# EAGLE design PCB-BI8-1x8SC3x (EAGLE 7.5.0)
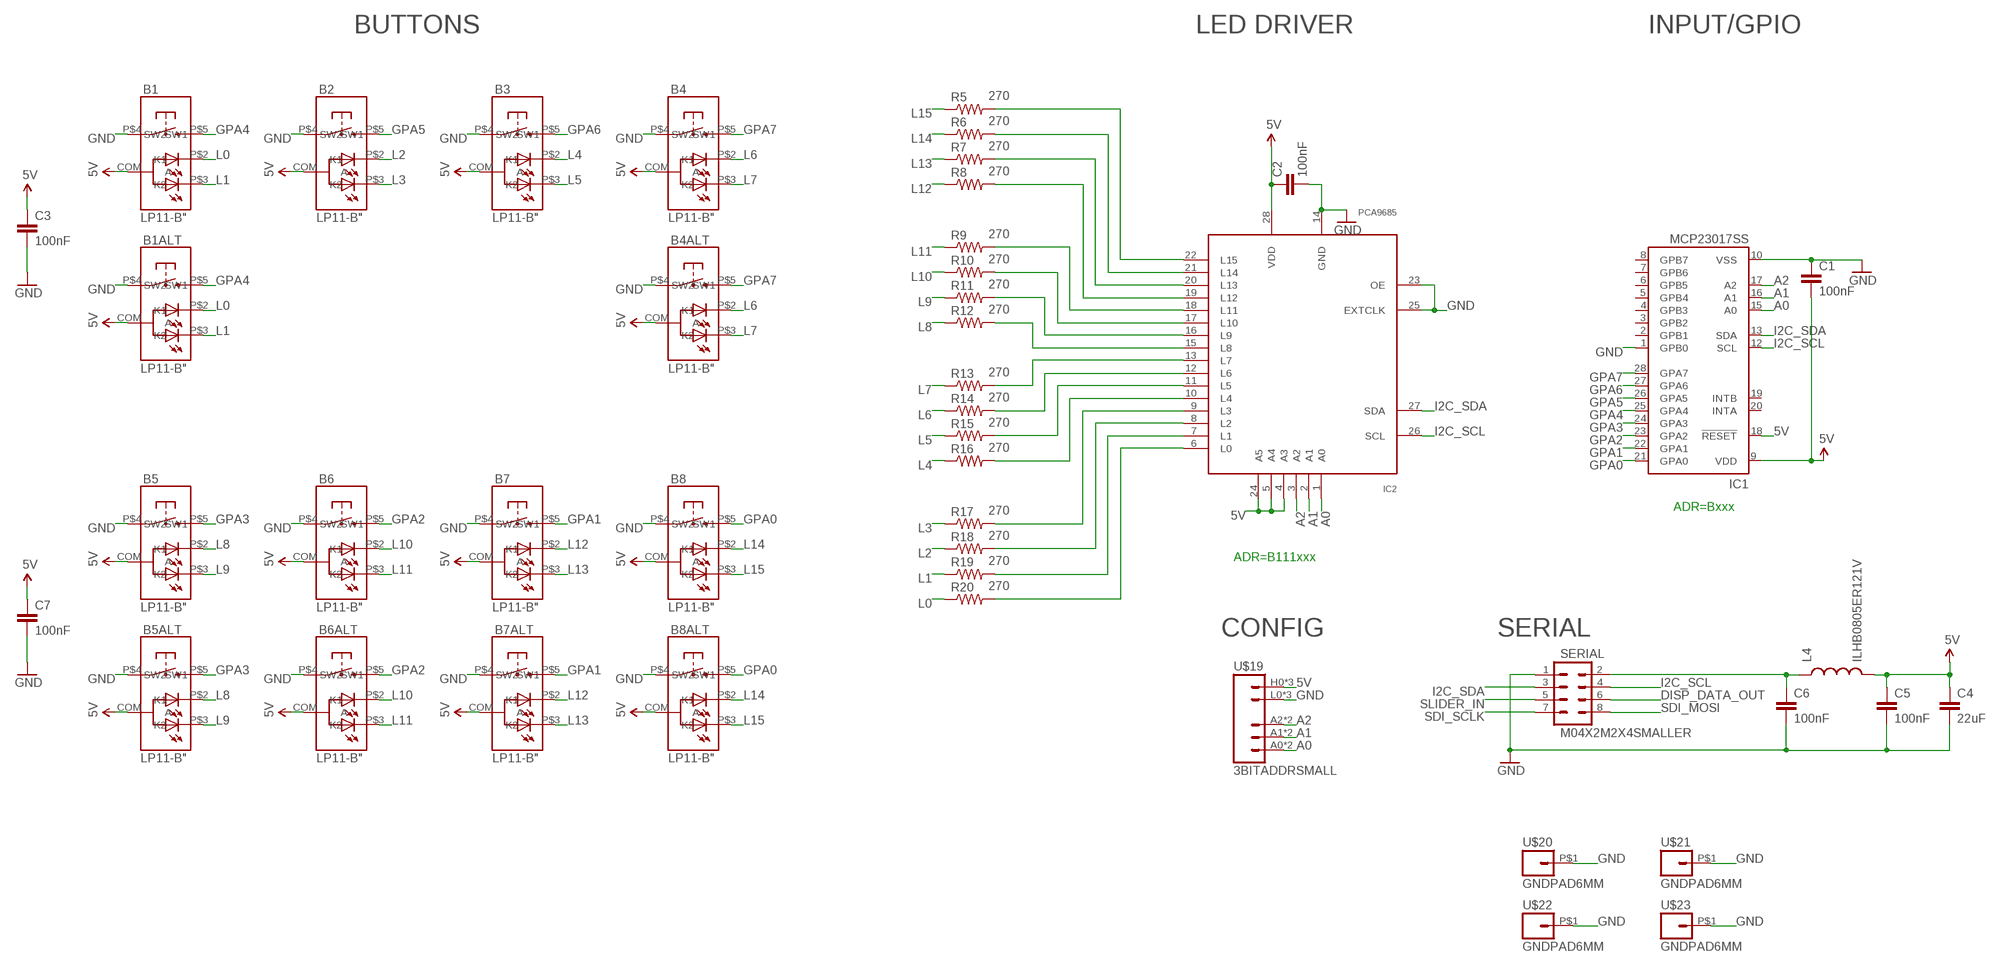
[diagram p0: schematic, sheet 1]

## Parts
B1  LP11-B"  [LP11]
B1ALT  LP11-B"  [LP11]
B2  LP11-B"  [LP11]
B3  LP11-B"  [LP11]
B4  LP11-B"  [LP11]
B4ALT  LP11-B"  [LP11]
B5  LP11-B"  [LP11]
B5ALT  LP11-B"  [LP11]
B6  LP11-B"  [LP11]
B6ALT  LP11-B"  [LP11]
B7  LP11-B"  [LP11]
B7ALT  LP11-B"  [LP11]
B8  LP11-B"  [LP11]
B8ALT  LP11-B"  [LP11]
C1  100nF  CAP0603-CAP  [0603-CAP]
C2  100nF  CAP0603-CAP  [0603-CAP]
C3  100nF  CAP0603-CAP  [0603-CAP]
C4  22uF  CAP0805  [0805]
C5  100nF  CAP0603-CAP  [0603-CAP]
C6  100nF  CAP0603-CAP  [0603-CAP]
C7  100nF  CAP0603-CAP  [0603-CAP]
IC1  MCP23017SS  [SSOP28]
IC2  PCA9685  [TSSOP28]
L4  ILHB0805ER121V  INDUCTOR0805  [0805]
R5  270  RESISTOR0603-RES  [0603-RES]
R6  270  RESISTOR0603-RES  [0603-RES]
R7  270  RESISTOR0603-RES  [0603-RES]
R8  270  RESISTOR0603-RES  [0603-RES]
R9  270  RESISTOR0603-RES  [0603-RES]
R10  270  RESISTOR0603-RES  [0603-RES]
R11  270  RESISTOR0603-RES  [0603-RES]
R12  270  RESISTOR0603-RES  [0603-RES]
R13  270  RESISTOR0603-RES  [0603-RES]
R14  270  RESISTOR0603-RES  [0603-RES]
R15  270  RESISTOR0603-RES  [0603-RES]
R16  270  RESISTOR0603-RES  [0603-RES]
R17  270  RESISTOR0603-RES  [0603-RES]
R18  270  RESISTOR0603-RES  [0603-RES]
R19  270  RESISTOR0603-RES  [0603-RES]
R20  270  RESISTOR0603-RES  [0603-RES]
SERIAL  M04X2M2X4SMALLER  [M2X4SMALLER]
U$19  3BITADDRSMALL  [3BITADDR_SMALL]
U$20  GNDPAD6MM  [3.2MMPAD6MM]
U$21  GNDPAD6MM  [3.2MMPAD6MM]
U$22  GNDPAD6MM  [3.2MMPAD6MM]
U$23  GNDPAD6MM  [3.2MMPAD6MM]

## Nets
5V [Power]: B1.COM(A) B1ALT.COM(A) B2.COM(A) B3.COM(A) B4.COM(A) B4ALT.COM(A) B5.COM(A) B5ALT.COM(A) B6.COM(A) B6ALT.COM(A) B7.COM(A) B7ALT.COM(A) B8.COM(A) B8ALT.COM(A) C1.2 C2.1 C3.1 C4.1 C5.1 C7.1 IC1.9(VDD) IC1.18(!RESET) IC2.4(A3) IC2.5(A4) IC2.24(A5) IC2.28(VDD) L4.2 U$19.H0(VCC) U$19.H1(VCC) U$19.H2(VCC)
A0: IC1.15(A0) IC2.1(A0) U$19.A0 U$19.AS0(A0)
A1: IC1.16(A1) IC2.2(A1) U$19.A1 U$19.AS1(A1)
A2: IC1.17(A2) IC2.3(A2) U$19.A2 U$19.AS2(A2)
DISP_DATA_OUT: SERIAL.6
GND [Power]: B1.P$4(SW1) B1ALT.P$4(SW1) B2.P$4(SW1) B3.P$4(SW1) B4.P$4(SW1) B4ALT.P$4(SW1) B5.P$4(SW1) B5ALT.P$4(SW1) B6.P$4(SW1) B6ALT.P$4(SW1) B7.P$4(SW1) B7ALT.P$4(SW1) B8.P$4(SW1) B8ALT.P$4(SW1) C1.1 C2.2 C3.2 C4.2 C5.2 C6.2 C7.2 IC1.1(GPB0) IC1.10(VSS) IC2.14(GND) IC2.23(OE) IC2.25(EXTCLK) SERIAL.1 U$19.L0(GND) U$19.L1(GND) U$19.L2(GND) U$20.P$1 U$21.P$1 U$22.P$1 U$23.P$1
GPA0: B8.P$5(SW2) B8ALT.P$5(SW2) IC1.21(GPA0)
GPA1: B7.P$5(SW2) B7ALT.P$5(SW2) IC1.22(GPA1)
GPA2: B6.P$5(SW2) B6ALT.P$5(SW2) IC1.23(GPA2)
GPA3: B5.P$5(SW2) B5ALT.P$5(SW2) IC1.24(GPA3)
GPA4: B1.P$5(SW2) B1ALT.P$5(SW2) IC1.25(GPA4)
GPA5: B2.P$5(SW2) IC1.26(GPA5)
GPA6: B3.P$5(SW2) IC1.27(GPA6)
GPA7: B4.P$5(SW2) B4ALT.P$5(SW2) IC1.28(GPA7)
I2C_SCL: IC1.12(SCL) IC2.26(SCL) SERIAL.4
I2C_SDA: IC1.13(SDA) IC2.27(SDA) SERIAL.3
L0: B1.P$2(K1) B1ALT.P$2(K1) R20.1
L1: B1.P$3(K2) B1ALT.P$3(K2) R19.1
L2: B2.P$2(K1) R18.1
L3: B2.P$3(K2) R17.1
L4: B3.P$2(K1) R16.1
L5: B3.P$3(K2) R15.1
L6: B4.P$2(K1) B4ALT.P$2(K1) R14.1
L7: B4.P$3(K2) B4ALT.P$3(K2) R13.1
L8: B5.P$2(K1) B5ALT.P$2(K1) R12.1
L9: B5.P$3(K2) B5ALT.P$3(K2) R11.1
L10: B6.P$2(K1) B6ALT.P$2(K1) R10.1
L11: B6.P$3(K2) B6ALT.P$3(K2) R9.1
L12: B7.P$2(K1) B7ALT.P$2(K1) R8.1
L13: B7.P$3(K2) B7ALT.P$3(K2) R7.1
L14: B8.P$2(K1) B8ALT.P$2(K1) R6.1
L15: B8.P$3(K2) B8ALT.P$3(K2) R5.1
N$1 [Power]: C6.1 L4.1 SERIAL.2
N$4: IC2.13(L7) R13.2
N$5: IC2.12(L6) R14.2
N$7: IC2.11(L5) R15.2
N$9: IC2.10(L4) R16.2
N$10: IC2.9(L3) R17.2
N$11: IC2.8(L2) R18.2
N$12: IC2.7(L1) R19.2
N$19: IC2.6(L0) R20.2
N$20: IC2.15(L8) R12.2
N$21: IC2.16(L9) R11.2
N$22: IC2.17(L10) R10.2
N$23: IC2.18(L11) R9.2
N$24: IC2.19(L12) R8.2
N$25: IC2.20(L13) R7.2
N$26: IC2.21(L14) R6.2
N$27: IC2.22(L15) R5.2
SDI_MOSI: SERIAL.8
SDI_SCLK: SERIAL.7
SLIDER_IN: SERIAL.5
Unconnected: IC1.2(GPB1) IC1.3(GPB2) IC1.4(GPB3) IC1.5(GPB4) IC1.6(GPB5) IC1.7(GPB6) IC1.8(GPB7) IC1.19(INTB) IC1.20(INTA)

## Notes on the sheet
- BUTTONS | LED DRIVER | INPUT/GPIO
- ADR=Bxxx
- ADR=B111xxx
- CONFIG | SERIAL

## Library data of the parts
B1 B1ALT B2-B4 B4ALT B5 B5ALT B6 B6ALT B7 B7ALT B8 B8ALT = SKAARHOJ:LP11-B
C1-C7 = SparkFun:CAP: Capacitor Standard 0603 ceramic capacitor, and 0.1" leaded capacitor.
IC1 = microchip:MCP23017: http://ww1.microchip.com/downloads/en/DeviceDoc/21952a.pdf Source: http://ww1.microchip.com/downloads/en/DeviceDoc/21952a.pdf; MF: MICROCHIP; MPN: MCP23017-E/SS; OC_FARNELL: 1467674; OC_NEWARK: 31K2960
IC2 = wsmith:PCA9685
L4 = SparkFun:INDUCTOR: Inductors Basic Inductor/Choke - 0603 and 1206. Footprints are not proven and vary greatly between part numbers.
R5-R20 = SparkFun:RESISTOR: Resistor Basic schematic elements and footprints for 0603, 1206, and PTH resistors.
SERIAL = SKAARHOJ:M04X2
U$19 = SKAARHOJ:3BITADDR
U$20-U$23 = SKAARHOJ:GNDPAD

## Net classes
0 default: width 0.203 mm, drill 0.406 mm, clearance 0.203 mm
1 Power: width 0.356 mm, drill 0.61 mm, clearance 0.203 mm

## Board
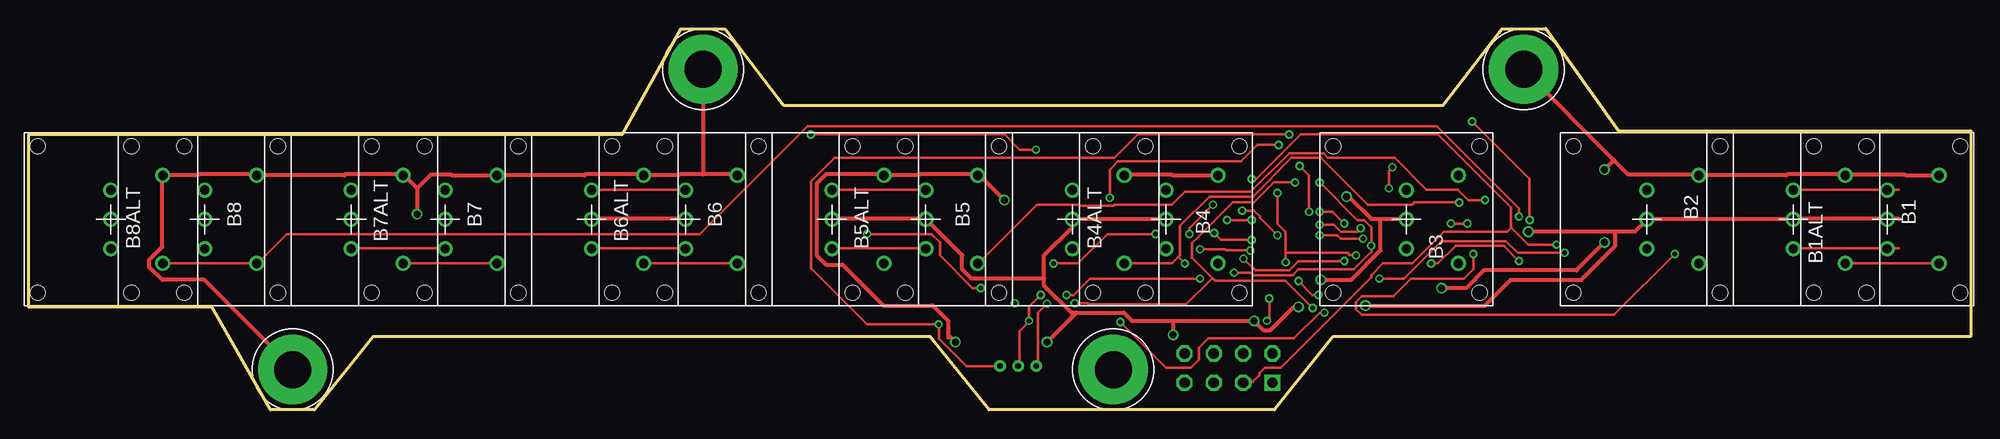
[diagram p1: board, top side]
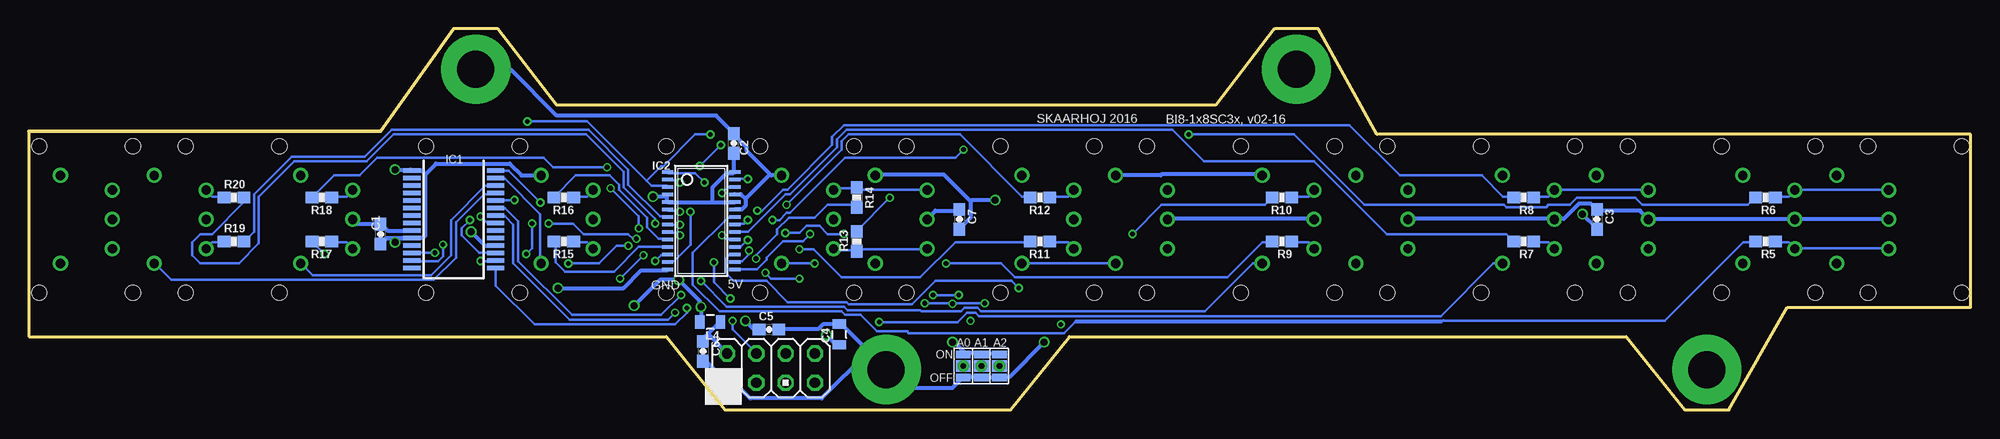
[diagram p2: board, bottom side, seen from below]

Size 168.27 x 33.02 mm. Coordinates in mm from the lower left corner, seen from the top.
Outline: 0,23.88 51.43,23.88 56.52,33.02 60.32,33.02 65.41,26.42 122.56,26.42 127.64,33.02 131.44,33.02 137.79,24.13 168.27,24.13 168.27,6.35 113.03,6.35 107.95,0 83.19,0 78.11,6.35 29.85,6.35 24.77,0 20.96,0 15.88,8.89 0,8.89 0,23.88
Copper layers (1*16): Top 0.035mm / dielectric 1.5mm / Bottom 0.035mm
Design rules "Fusion_eagle_rule_v1.1": minimum track width 6mil, minimum drill 12mil, track to track 6mil, track to pad 6mil, pad to pad 6mil, via to via 6mil, smd to smd 0mil, copper to edge 10mil, drill to drill 10mil, minimum pad ring 10mil, minimum via ring 6mil, stop-mask expansion 2mil, vias tented up to drill 100mil, thermal gap 10mil

### Footprints (pad centres in the part's own frame; a part is rotated, then mirrored left to right if it is on the bottom)
LP11 = drill 0.8: COM 0,0; P$2 0,2.54; P$3 0,-2.54; P$4 4.5,3.81; P$5 4.5,-3.81 | hole 1.3: -6.35,6.35; 6.35,6.35; 6.35,-6.35; -6.35,-6.35
0603-CAP = smd 1.1 x 1: 1 -0.85,0; 2 0.85,0
0805 = smd 0.8 x 1.2: 1 -0.9,0; 2 0.9,0
SSOP28 = smd 0.4 x 1.5: 1 -4.225,-3.625; 2 -3.575,-3.625; 3 -2.925,-3.625; 4 -2.275,-3.625; 5 -1.625,-3.625; 6 -0.975,-3.625; 7 -0.325,-3.625; 8 0.325,-3.625; 9 0.975,-3.625; 10 1.625,-3.625; 11 2.275,-3.625; 12 2.925,-3.625; 13 3.575,-3.625; 14 4.225,-3.625; 15 4.225,3.625; 16 3.575,3.625; 17 2.925,3.625; 18 2.275,3.625; 19 1.625,3.625; 20 0.975,3.625; 21 0.325,3.625; 22 -0.325,3.625; 23 -0.975,3.625; 24 -1.625,3.625; 25 -2.275,3.625; 26 -2.925,3.625; 27 -3.575,3.625; 28 -4.225,3.625
TSSOP28 = smd 0.305 x 0.991: 1 -4.225,-2.918; 2 -3.575,-2.918; 3 -2.925,-2.918; 4 -2.275,-2.918; 5 -1.625,-2.918; 6 -0.975,-2.918; 7 -0.325,-2.918; 8 0.325,-2.918; 9 0.975,-2.918; 10 1.625,-2.918; 11 2.275,-2.918; 12 2.925,-2.918; 13 3.575,-2.918; 14 4.225,-2.918; 15 4.225,2.918; 16 3.575,2.918; 17 2.925,2.918; 18 2.275,2.918; 19 1.625,2.918; 20 0.975,2.918; 21 0.325,2.918; 22 -0.325,2.918; 23 -0.975,2.918; 24 -1.625,2.918; 25 -2.275,2.918; 26 -2.925,2.918; 27 -3.575,2.918; 28 -4.225,2.918
0603-RES = smd 1.1 x 1: 1 -0.85,0; 2 0.85,0
M2X4SMALLER = drill 0.9 square: 1 -1.27,3.81 | drill 0.9 octagon: 2 1.27,3.81; 3 -1.27,1.27; 4 1.27,1.27; 5 -1.27,-1.27; 6 1.27,-1.27; 7 -1.27,-3.81; 8 1.27,-3.81
3BITADDR_SMALL = drill 0.5: A0 -1.565,0; A1 0,0; A2 1.565,0 | smd 1.27 x 1: AS0 -1.565,0; AS1 0,0; AS2 1.565,0 | smd 1.27 x 0.635: H0 -1.565,1; H1 0,1; H2 1.565,1; L0 -1.565,-1; L1 0,-1; L2 1.565,-1
3.2MMPAD6MM = drill 3.2 pad 6: P$1 0,0

### Placement (x,y rotation side)
B1  161.04,16.51 0 top
B1ALT  152.91,16.51 0 top
B2  140.21,16.51 0 top
B3  119.38,16.51 0 top
B4  98.55,16.51 0 top
B4ALT  90.42,16.51 0 top
B5  77.72,16.51 0 top
B5ALT  69.6,16.51 0 top
B6  56.9,16.51 0 top
B6ALT  48.77,16.51 0 top
B7  36.07,16.51 0 top
B7ALT  27.94,16.51 0 top
B8  15.24,16.51 0 top
B8ALT  7.11,16.51 0 top
C1  137.79,15.24 90 bottom
C2  107.19,23.09 90 bottom
C3  32.38,16.51 270 bottom
C4  98.04,6.55 90 bottom
C5  104.14,6.99 0 bottom
C6  109.86,5.08 270 bottom
C7  87.63,16.51 270 bottom
IC1  131.44,16.51 270 bottom
IC2  110.01,16.38 270 bottom
L4  109.22,7.62 180 bottom
R5  17.78,14.61 180 bottom
R6  17.78,18.41 180 bottom
R7  38.73,14.61 180 bottom
R8  38.73,18.41 180 bottom
R9  59.69,14.61 180 bottom
R10  59.69,18.41 180 bottom
R11  80.65,14.61 180 bottom
R12  80.65,18.41 180 bottom
R13  96.52,14.61 90 bottom
R14  96.52,18.41 270 bottom
R15  121.92,14.61 180 bottom
R16  121.92,18.41 180 bottom
R17  142.88,14.61 180 bottom
R18  142.88,18.41 180 bottom
R19  150.49,14.61 0 bottom
R20  150.49,18.41 0 bottom
SERIAL  103.96,3.63 90 bottom
U$19  85.73,3.81 0 bottom
U$20  22.86,3.5 0 top
U$21  93.98,3.5 0 top
U$22  129.54,29.52 0 top
U$23  58.42,29.52 0 top

### Tracks (layer width: path | path; a pad name or v marks a point on that pad's centre or on a via)
5V  (via drill 0.61)
  Top 0.356: B5ALT.COM 69.6,16.56 77.72,16.56 B5.COM 77.83,16.46 80.87,13.41 80.87,12.19 81.69,11.38 87.99,11.38 | B6ALT.COM 48.77,16.56 56.9,16.56 B6.COM | B1.COM 162.05,16.56 152.91,16.56 B1ALT.COM 152.81,16.56 140.31,16.56 B2.COM 140.21,16.46 139.19,15.44 137.47,15.44 | 137.47,15.44 v129.95,15.44 | 117.15,16.56 116.33,16.56 114.4,18.49 v114.2,18.49 | 117.15,16.56 119.38,16.56 B3.COM | B4.COM 98.55,16.56 90.42,16.56 B4ALT.COM 90.42,15.85 87.99,13.41 87.99,11.38 | 99.16,7.72 95.61,7.72 94.89,8.43 90.77,8.43 | 99.16,7.72 v106.17,7.72 106.98,6.91 107.59,6.91 109.63,8.94 v110.03,8.94 | 90.77,8.43 90.53,8.43 90.42,8.33 87.99,10.77 87.99,11.38 | 99.16,7.72 v99.16,6.5 | 117.15,16.56 117.15,13.82 114.61,11.28 v111.96,11.28 | 137.47,15.44 137.47,14.22 134.52,11.28 128.42,11.28 126.19,9.04 v115.82,9.04 | v88.23,5.87 90.77,8.41 90.77,8.43
  Bottom 0.356: B8ALT.COM 7.62,16.56 15.24,16.56 B8.COM 15.34,16.56 27.84,16.56 B7ALT.COM 27.94,16.56 28.65,17.27 32.31,17.27 C3.1 32.51,17.48 32.92,17.88 33.93,17.88 35.25,16.56 36.07,16.56 B7.COM 36.17,16.56 48.77,16.56 B6ALT.COM | B5ALT.COM 69.6,16.56 56.9,16.56 B6.COM | B2.COM 140.21,16.46 139.9,16.15 137.87,16.15 C1.2 137.67,16.05 137.16,15.54 135.13,15.54 IC1.9 | v129.95,15.44 128.73,14.22 127.91,14.22 IC1.18 | C2.1 107.19,20.62 IC2.28 107.29,20.52 107.8,20.52 109.02,19.3 109.02,17.98 | 109.02,17.98 112.88,17.98 IC2.5 112.98,18.09 112.98,18.49 | 109.02,17.98 107.19,17.98 IC2.24 | 112.98,18.49 112.98,18.59 IC2.4 | 112.98,18.49 v114.2,18.49 | C7.1 87.68,17.27 89.71,17.27 90.42,16.56 B4ALT.COM | v106.17,7.72 105.46,7.01 105.05,7.01 C5.1 | v99.16,6.5 98.35,5.69 98.04,5.69 C4.1 | L4.2 110.03,7.62 v110.03,8.94 110.13,9.04 110.13,9.45 v111.96,11.28 113.59,11.28 v115.82,9.04 | U$19.H2 84.26,4.92 85.69,4.92 U$19.H1 85.85,4.92 87.28,4.92 U$19.H0 87.28,5.08 88.07,5.87 v88.23,5.87
A0  (via drill 0.41)
  Top 0.203: v109.73,19.71 107.9,19.71 106.17,17.98 104.34,17.98 100.79,14.43 100.79,13.21 102.56,11.43 | 102.56,11.43 102.82,11.18 108.92,11.18 v111.25,8.84 | v90.63,9.25 91.75,9.25 91.85,9.14 100.28,9.14 102.56,11.43 | v88.23,9.21 87.44,8.41 87.44,3.81 U$19.AS0
  Bottom 0.203: v109.73,19.71 110.54,20.52 112.88,20.52 IC2.1 | v111.25,8.84 111.25,8.43 112.27,7.42 124.46,7.42 127.81,10.77 127.81,12.19 IC1.15 | v90.63,9.25 88.23,9.25 | 88.23,9.25 v85.45,9.25 | 87.44,3.81 U$19.AS0 | v88.23,9.21 88.23,9.25
A1  (via drill 0.41)
  Top 0.203: v111.86,19.71 115.11,16.46 115.72,16.46 116.33,15.85 v116.33,14.22 116.33,13.72 114.81,12.19 110.03,12.19 109.53,11.68 106.07,11.68 105.87,11.89 v104.45,11.89 | v121.51,12.7 122.12,12.7 123.65,14.22 127.81,14.22 v129.13,12.9 | v87.68,9.96 86.67,8.94 v86.67,7.72 86.65,7.62 85.85,6.83 85.85,3.81 U$19.AS1 | v89.92,9.96 90.53,9.96 91.95,11.38 v101.5,11.38
  Bottom 0.203: v111.86,19.71 112.06,19.91 112.88,19.91 IC2.2 | v116.33,14.22 117.35,14.22 118.87,12.7 v121.51,12.7 | v129.13,12.9 127.91,12.9 IC1.16 | v89.92,9.96 v87.68,9.96 | v101.5,11.38 103.94,11.38 v104.45,11.89 | 85.85,3.81 U$19.AS1
A2  (via drill 0.41)
  Top 0.203: v125.07,24.99 130.05,20.02 v130.05,16.46 | v109.22,23.88 96.11,23.88 94.08,21.84 69.8,21.84 67.77,19.81 67.77,12.29 72.64,7.42 v78.84,7.42 78.87,7.3 78.87,6.19 81.25,3.81 U$19.AS2
  Bottom 0.203: 114.76,19.86 119.89,24.99 v125.07,24.99 | 114.76,19.86 114.3,19.41 112.98,19.41 IC2.3 | v130.05,16.46 130.76,15.75 130.76,15.14 129.23,13.61 127.91,13.61 IC1.17 | v109.22,23.88 110.54,23.88 113.28,21.13 113.49,21.13 114.76,19.86 | 84.26,3.81 U$19.AS2
GND  (via drill 0.61)
  Top 0.356: v122.43,10.57 124.56,10.57 126.09,12.09 134.11,12.09 v136.55,14.53 | B1.P$4 162.66,20.32 162.56,20.42 157.48,20.42 B1ALT.P$4 157.38,20.32 157.28,20.42 152.4,20.42 152.3,20.32 B2.P$4 144.58,20.42 138.58,20.42 137.36,21.64 | 137.36,21.64 129.54,29.46 U$22.P$1 | 137.36,21.64 v136.55,20.83 | 33.63,19.2 v33.63,16.97 | 33.63,19.2 32.51,20.32 B7ALT.P$4 32.31,20.42 27.43,20.42 27.33,20.32 B8.P$4 19.71,20.32 19.61,20.42 14.73,20.42 14.63,20.32 B8ALT.P$4 11.56,20.16 11.56,14.13 10.45,13.02 10.45,12.38 11.56,11.27 15.21,11.27 22.83,3.65 U$20.P$1 | 33.63,19.2 34.85,20.42 36.58,20.42 36.68,20.32 B7.P$4 48.16,20.32 48.26,20.42 53.14,20.42 B6ALT.P$4 56.29,20.32 56.39,20.42 58.42,20.42 | B4.P$4 99.16,20.32 99.06,20.42 95.1,20.42 95,20.32 B4ALT.P$4 | 58.42,20.42 61.27,20.42 61.37,20.32 B6.P$4 | U$23.P$1 58.42,20.42 | v84.53,18.19 82.4,20.32 B5.P$4 82.19,20.32 82.09,20.42 77.22,20.42 77.11,20.32 B5ALT.P$4 73.97,20.42 69.09,20.42 68.28,19.61 68.28,13.41 69.09,12.6 70.51,12.6 74.07,9.04 78.33,9.04 79.65,7.72 79.65,6.35 | 79.65,6.35 79.65,6.3 | v80.3,5.87 79.82,6.35 79.65,6.35
  Bottom 0.356: v122.43,10.57 116.74,10.57 115.21,12.09 112.98,12.09 IC2.14 | 136.55,14.88 v136.55,14.53 | 133.91,20.42 134.21,20.73 135.03,20.73 IC1.1 135.23,20.83 v136.55,20.83 | 133.91,20.42 133.91,15.14 134.11,14.94 134.92,14.94 IC1.10 | B3.P$4 125.58,20.32 126.59,21.34 132.99,21.34 133.91,20.42 | v33.63,16.97 32.41,15.75 C3.2 | C6.2 109.83,4.17 109.53,4.17 107.8,2.44 SERIAL.1 107.59,2.34 107.09,2.34 105.77,1.02 99.57,1.02 95.61,4.98 U$21.P$1 | C5.2 103.23,7.01 99.87,7.01 99.47,7.42 98.04,7.42 C4.2 97.94,7.32 97.74,7.32 93.98,3.56 U$21.P$1 | 92.35,1.83 93.88,3.35 U$21.P$1 | 106.17,18.29 106.17,17.68 106.48,17.37 107.09,17.37 IC2.23 | 106.17,18.29 106.58,18.69 107.09,18.69 IC2.25 | 104.04,20.42 103.94,20.32 B4.P$4 | 104.04,20.42 106.07,22.45 106.07,22.76 107.19,23.88 C2.2 107.29,24.08 108.71,25.5 122.53,25.5 126.49,29.46 129.54,29.46 U$22.P$1 | 104.04,20.42 106.17,18.29 | 86.67,18.09 86.67,16.66 87.58,15.75 C7.2 | 86.67,18.09 89,20.42 94.79,20.42 94.89,20.32 B4ALT.P$4 | B5ALT.P$4 70.21,20.32 70.1,20.42 61.57,20.42 61.47,20.32 B6.P$4 | v84.53,18.19 86.56,18.19 86.67,18.09 | U$21.P$1 92.2,1.91 88.23,1.91 87.44,2.7 U$19.L0 87.28,2.86 85.85,2.86 U$19.L1 85.69,2.86 84.26,2.86 U$19.L2 84.11,2.86 83.31,2.86 v80.3,5.87
  Bottom 0.406: IC1.10 136.55,14.88 137.3,14.88 C1.1
GPA0  (via drill 0.41)
  Top 0.203: v129.13,16.76 129.13,17.48 122.02,24.59 67.46,24.59 58.11,15.24 22.35,15.24 19.81,12.7 B8.P$5 B8ALT.P$5
  Bottom 0.203: v129.13,16.76 128.63,16.26 127.91,16.26 IC1.21
GPA1  (via drill 0.41)
  Top 0.203: v112.27,8.43 111.86,8.43 109.63,6.2 102.21,6.2 101.4,5.38 101.4,4.37 100.69,3.66 98.55,3.66 v94.59,7.62 | B7.P$5 B7ALT.P$5
  Bottom 0.203: v112.27,8.43 112.88,7.82 121.41,7.82 126.29,12.7 126.29,16.05 127,16.76 127.81,16.76 IC1.22 | v94.59,7.62 87.78,7.62 86.97,8.43 86.26,8.43 85.95,8.13 45.92,8.13 41.35,12.7 B7.P$5
GPA2  (via drill 0.41)
  Top 0.203: v111.76,9.96 111.25,9.96 v110.03,11.18 | B6.P$5 B6ALT.P$5
  Bottom 0.203: v111.76,9.96 113.49,8.23 121.21,8.23 125.88,12.9 125.88,16.36 127,17.48 127.81,17.48 IC1.23 | v110.03,11.18 107.8,8.94 97.64,8.94 97.33,8.64 91.03,8.64 90.93,8.53 87.48,8.53 87.17,8.84 86.06,8.84 85.75,8.53 66.34,8.53 62.18,12.7 B6.P$5
GPA3  (via drill 0.41)
  Top 0.203: v126.19,18.19 124.77,18.19 123.85,19.1 121.11,19.1 118.36,21.84 112.57,21.84 112.17,22.25 109.22,22.25 105.87,18.9 100.18,18.9 99.06,17.78 94.08,17.78 93.98,17.68 91.03,17.68 90.93,17.78 87.38,17.78 82.3,12.7 B5.P$5
  Bottom 0.203: v126.19,18.19 127.81,18.19 IC1.24 | B5.P$5 B5ALT.P$5
GPA4
  Top 0.203: B1ALT.P$5 B1.P$5
  Bottom 0.203: IC1.25 127.91,18.69 128.83,18.69 131.27,16.26 131.27,13.21 133.2,11.28 155.96,11.28 157.38,12.7 B1ALT.P$5
GPA5
  Bottom 0.203: IC1.26 127.91,19.41 128.73,19.41 131.67,16.46 131.67,13.41 133.4,11.68 143.66,11.68 144.68,12.7 B2.P$5
GPA6
  Bottom 0.203: IC1.27 127.81,20.02 127,20.02 123.95,16.97 123.95,12.7 B3.P$5
GPA7  (via drill 0.41)
  Top 0.203: v123.95,17.98 120.09,17.98 119.89,17.78 116.03,17.78 111.96,21.84 109.42,21.84 106.07,18.49 102.31,18.49 99.77,15.95 99.77,13.41 99.62,13.26 | 99.62,13.26 99.06,12.7 B4ALT.P$5 | 99.62,13.26 v100.18,12.7
  Bottom 0.203: v123.95,17.98 126.7,20.73 IC1.28 | v100.18,12.7 B4.P$5
I2C_SCL  (via drill 0.41)
  Top 0.203: v108.2,18.8 108.2,16.15 108.92,15.44 108.92,13.61 | v108.92,12.8 108.92,13.61 | v107.49,9.65 107.49,7.92 v107.29,7.72 | v133.1,13.61 129.03,13.61 128.02,14.63 122.43,14.63 119.18,11.38 v117.04,11.38 | v115.01,13.41 114.5,13.41 114.3,13.61 108.92,13.61
  Bottom 0.203: v108.2,18.8 107.7,19.3 107.19,19.3 IC2.26 | v108.92,12.8 108.92,11.07 v107.49,9.65 | v107.29,7.72 107.29,7.01 105.26,4.98 SERIAL.4 | v133.1,13.61 135.03,13.61 IC1.12 | v115.01,13.41 v117.04,11.38
I2C_SDA  (via drill 0.41)
  Top 0.203: v105.97,20.02 106.38,20.02 110.24,23.88 122.12,23.88 128.42,17.58 128.42,15.85 128.47,15.8 | 128.47,15.8 129.95,14.33 v132.38,14.33 | 106.07,2.44 106.01,2.44 | 106.01,2.44 105.26,2.44 SERIAL.3 | 128.47,15.8 128.12,15.44 122.63,15.44 119.89,12.7 117.35,12.7 116.33,11.68 116.33,11.48 108.51,3.66 107.29,3.66 107.28,3.65 107.12,3.65 106.65,3.17 106.65,3.02 106.01,2.38 106.01,2.44
  Bottom 0.203: v105.97,20.02 107.09,20.02 IC2.27 | v132.38,14.33 132.38,13.31 132.79,12.9 135.03,12.9 IC1.13
L0
  Top 0.203: B1ALT.P$2 152.91,19.1 162.05,19.1 B1.P$2
  Bottom 0.203: R20.1 151.38,18.49 152.4,18.49 152.91,19 B1ALT.P$2
L1
  Top 0.203: B1ALT.P$3 152.91,14.02 162.05,14.02 B1.P$3
  Bottom 0.203: R19.1 151.38,14.53 152.4,14.53 152.91,14.02 B1ALT.P$3
L2
  Bottom 0.203: R18.1 141.94,18.49 140.72,18.49 140.21,19 B2.P$2
L3
  Bottom 0.203: R17.1 141.94,14.53 140.72,14.53 140.21,14.02 B2.P$3
L4
  Bottom 0.203: R16.1 121.01,18.49 119.89,18.49 119.38,19 B3.P$2
L5
  Bottom 0.203: R15.1 121.01,14.53 119.89,14.53 119.38,14.02 B3.P$3
L6
  Bottom 0.203: 96.52,19.2 98.45,19.2 98.55,19.1 B4.P$2 | 96.52,19.2 96.42,19.1 90.42,19.1 B4ALT.P$2 | 96.52,19.2 R14.1
L7
  Bottom 0.203: 96.52,13.82 98.45,13.82 98.55,13.92 B4.P$3 | 96.52,13.82 96.42,13.92 90.42,13.92 B4ALT.P$3 | 96.52,13.82 R13.1
L8
  Top 0.203: B5ALT.P$2 69.6,19.1 77.72,19.1 B5.P$2
  Bottom 0.203: R12.1 79.76,18.49 78.23,18.49 77.72,19 B5.P$2
L9
  Top 0.203: B5ALT.P$3 69.6,14.02 77.72,14.02 B5.P$3
  Bottom 0.203: R11.1 79.76,14.53 78.23,14.53 77.72,14.02 B5.P$3
L10
  Top 0.203: B6ALT.P$2 48.77,19.1 56.9,19.1 B6.P$2
  Bottom 0.203: R10.1 58.83,18.49 57.4,18.49 56.9,19 B6.P$2
L11
  Top 0.203: B6ALT.P$3 48.77,14.02 56.9,14.02 B6.P$3
  Bottom 0.203: R9.1 58.83,14.53 57.4,14.53 56.9,14.02 B6.P$3
L12
  Bottom 0.203: R8.1 37.79,18.49 36.58,18.49 36.07,19 B7.P$2 36.07,19.1 27.94,19.1 B7ALT.P$2
L13
  Top 0.203: B7ALT.P$3 27.94,14.02 36.07,14.02 B7.P$3
  Bottom 0.203: R7.1 37.79,14.53 36.58,14.53 36.07,14.02 B7.P$3
L14
  Bottom 0.203: R6.1 16.87,18.49 15.75,18.49 15.24,19 B8.P$2 15.24,19.1 7.62,19.1 B8ALT.P$2
L15
  Bottom 0.203: 15.24,14.02 15.75,14.53 16.87,14.53 R5.1 | 15.24,14.02 7.62,14.02 B8ALT.P$3 | 15.24,14.02 B8.P$3
N$1
  Bottom 0.356: 109.42,6.6 108.41,7.62 L4.1 | 109.42,6.6 109.83,6.2 109.83,5.99 C6.1 | 109.42,6.6 107.8,4.98 SERIAL.2
N$4  (via drill 0.41)
  Top 0.203: v110.95,17.17 110.95,20.32 v110.13,21.13 | v108.31,22.96 106.48,22.96 105.05,21.54 94.39,21.54 93.68,20.83 v93.68,18.39
  Bottom 0.203: v110.95,17.17 110.95,14.33 112.37,12.9 112.88,12.9 IC2.13 | v108.31,22.96 v110.13,21.13 | v93.68,18.39 96.52,15.54 R13.2
N$5  (via drill 0.41)
  Top 0.203: v114,12.9 110.03,12.9 109.22,12.09 106.27,12.09 v105.26,13.11
  Bottom 0.203: v114,12.9 113.49,13.41 112.98,13.41 IC2.12 | v105.26,13.11 105.26,13.41 103.43,15.24 103.43,15.65 102.41,16.66 100.18,16.66 99.06,17.78 96.72,17.78 96.52,17.58 R14.2
N$7
  Bottom 0.203: IC2.11 112.98,14.12 115.42,14.12 117.55,11.99 121.82,11.99 122.63,12.8 122.63,14.43 122.73,14.53 R15.2
N$9
  Bottom 0.203: IC2.10 112.98,14.83 113.69,14.83 114.71,15.85 114.71,16.66 117.15,19.1 117.15,19.51 117.96,20.32 120.9,20.32 122.73,18.49 R16.2
N$10  (via drill 0.41)
  Top 0.203: v111.86,15.14 113.39,15.14 113.69,14.83 v115.62,14.83 | v124.66,16.15 v123.24,16.15 | v125.17,13.51 125.17,12.19 124.36,11.38 119.79,11.38 118.26,9.86 115.52,9.86 115.01,9.35 115.01,8.74 115.52,8.23 137.36,8.23 v142.65,13.51
  Bottom 0.203: v111.86,15.14 112.06,15.34 112.88,15.34 IC2.9 | v115.62,14.83 115.93,14.83 116.33,15.24 120.19,15.24 121.11,16.15 v123.24,16.15 | v124.66,16.15 124.66,14.02 v125.17,13.51 | v142.65,13.51 143.66,14.53 R17.2
N$11  (via drill 0.41)
  Top 0.203: v111.86,16.05 113.08,16.05 113.69,15.44 115.11,15.44 v115.42,15.75 | v117.86,19.2 117.86,20.73 v118.16,21.03
  Bottom 0.203: v111.86,16.05 112.88,16.05 IC2.8 | v115.42,15.75 115.42,16.76 v117.86,19.2 | v118.16,21.03 122.83,21.03 123.65,21.84 138.07,21.84 139.6,20.32 141.83,20.32 143.66,18.49 R18.2
N$12
  Bottom 0.203: IC2.7 112.98,16.76 113.59,16.76 116.33,19.51 116.33,20.83 119.79,24.28 136.85,24.28 139.19,21.95 145.49,21.95 148.74,18.69 148.74,15.44 149.55,14.63 R19.2
N$19  (via drill 0.41)
  Top 0.203: v111.86,17.17 112.98,17.17 v114,16.15
  Bottom 0.203: v111.86,17.17 111.96,17.27 112.88,17.27 IC2.6 | v114,16.15 114,16.56 116.74,19.3 116.74,20.62 119.99,23.88 136.65,23.88 138.99,21.54 145.29,21.54 148.34,18.49 148.34,14.43 150.06,12.7 153.42,12.7 154.13,13.41 154.13,14.53 153.42,15.24 152.4,15.24 149.66,17.98 149.66,18.39 R20.2
N$20  (via drill 0.41)
  Top 0.203: v100.58,15.24 100.58,15.75 v102.62,17.78
  Bottom 0.203: v100.58,15.24 101.19,14.63 102.92,14.63 104.34,13.21 104.34,13.01 105.16,12.19 107.09,12.19 IC2.15 | v102.62,17.78 97.84,22.55 97.84,23.27 97.23,23.88 87.58,23.88 82.19,18.49 81.59,18.49 R12.2
N$21  (via drill 0.41)
  Top 0.203: v105.87,13.82 103.73,13.82 103.63,13.92 v101.5,13.92
  Bottom 0.203: v105.87,13.82 105.87,13.51 106.48,12.9 107.09,12.9 IC2.16 | v101.5,13.92 100.28,13.92 97.84,11.48 91.03,11.48 87.99,14.53 81.59,14.53 R11.2
N$22  (via drill 0.41)
  Top 0.203: v82.5,10.57 81.79,10.57 78.94,13.41 78.94,14.53 78.23,15.24 v72.64,15.24
  Bottom 0.203: v82.5,10.57 83.11,11.18 89.71,11.18 91.75,9.14 97.23,9.14 97.43,9.35 102.51,9.35 104.34,11.18 107.19,11.18 107.9,11.89 107.9,13.11 107.59,13.41 107.19,13.41 IC2.17 | v72.64,15.24 70.1,17.78 61.16,17.78 60.55,18.39 R10.2
N$23  (via drill 0.41)
  Top 0.203: v105.97,14.73 103.33,14.73 v102.72,15.34 | v97.64,15.24 93.47,15.24 90.93,12.7 v88.8,12.7
  Bottom 0.203: v105.97,14.73 106.58,14.12 107.09,14.12 IC2.18 | v102.72,15.34 101.5,15.34 100.89,15.95 99.77,15.95 99.06,15.24 v97.64,15.24 | v88.8,12.7 84.02,12.7 82.8,11.48 64.41,11.48 61.37,14.53 60.55,14.53 R9.2
N$24  (via drill 0.41)
  Top 0.203: v108.2,15.14 106.68,16.66 106.68,16.76 106.17,17.27 v105.16,17.27
  Bottom 0.203: v108.2,15.14 107.9,14.83 107.19,14.83 IC2.19 | v105.16,17.27 104.75,17.27 102.92,19.1 102.51,19.1 98.65,22.96 98.65,23.67 97.64,24.69 53.85,24.69 49.48,20.32 42.37,20.32 40.54,18.49 39.62,18.49 R8.2
N$25
  Bottom 0.203: IC2.20 107.09,15.44 105.97,15.44 102.72,18.69 102.31,18.69 98.25,22.76 98.25,23.47 97.43,24.28 69.19,24.28 66.45,21.54 56.9,21.54 50.6,15.24 40.23,15.24 39.62,14.63 R7.2
N$26  (via drill 0.41)
  Top 0.203: v103.84,16.46 v105.97,16.46 | v87.27,22.55 85.85,22.55 84.53,23.88 v67.77,23.88
  Bottom 0.203: v105.97,16.46 106.27,16.15 107.09,16.15 IC2.21 | v103.84,16.46 103.23,16.46 102.62,17.07 102.31,17.07 97.54,21.84 87.99,21.84 v87.27,22.55 | v67.77,23.88 58.62,23.88 52.53,17.78 40.44,17.78 40.23,17.58 36.78,17.58 36.58,17.78 34.75,17.78 34.14,18.39 29.06,18.39 28.45,17.78 19.3,17.78 18.69,18.39 R6.2
N$27
  Bottom 0.203: 92.15,6.81 92.2,6.81 | 92.2,6.81 94.79,6.81 96.22,8.23 97.54,8.23 97.84,8.53 108.41,8.53 110.74,10.87 110.74,13.61 107.7,16.66 107.19,16.66 IC2.22 | 45.69,7.72 26.52,7.72 19.71,14.53 18.69,14.53 R5.2 | 45.69,7.72 77.52,7.72 | 92.2,6.81 92.2,6.83 92.04,6.67 78.55,6.67 77.6,7.62 45.85,7.62 45.69,7.78 45.69,7.72

### Text on the board
_bsilk: BI8-1x8SC3x, v02-16 | SKAARHOJ 2016 | GND | 5V